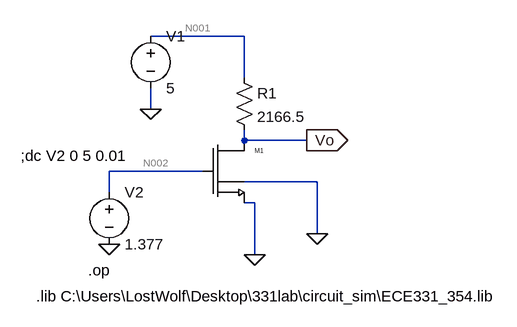
[diagram p0: schematic lab1_nmos.asc]
lab1_nmos.asc, the LTspice schematic file:
Version 4
SHEET 1 880 680
WIRE 176 -48 32 -48
WIRE 176 16 176 -48
WIRE 32 64 32 32
WIRE 176 112 176 96
WIRE 272 112 176 112
WIRE 112 160 -32 160
WIRE 288 176 176 176
WIRE -32 192 -32 160
WIRE 192 208 176 208
WIRE 288 256 288 176
WIRE 192 288 192 208
FLAG 192 288 0
FLAG 32 64 0
FLAG 288 256 0
FLAG -32 272 0
FLAG 272 112 Vo
IOPIN 272 112 Out
SYMBOL ALD1101 112 112 R0
SYMATTR InstName M1
SYMATTR SpiceModel ""
SYMATTR SpiceLine ""
SYMATTR Value ALD1101
SYMATTR Value2 W=1.379e-3 L=1E-6
SYMBOL res 160 0 R0
SYMATTR InstName R1
SYMATTR Value 2166.5
SYMBOL voltage 32 -64 R0
WINDOW 123 0 0 Left 2
WINDOW 39 0 0 Left 2
SYMATTR InstName V1
SYMATTR Value 5
SYMBOL voltage -32 176 R0
WINDOW 123 0 0 Left 2
WINDOW 39 0 0 Left 2
SYMATTR InstName V2
SYMATTR Value 1.377
TEXT -64 312 Left 2 !.op
TEXT -144 352 Left 2 !.lib C:\\Users\\LostWolf\\Desktop\\331lab\\circuit_sim\\ECE331_354.lib
TEXT -168 136 Left 2 !;dc V2 0 5 0.01

The netlist it stands for:
* lab1_nmos.asc
M1 Vo N002 0 0 ALD1101 W=1.379e-3 L=1E-6
R1 N001 Vo 2166.5
V1 N001 0 5
V2 N002 0 1.377
.model NMOS NMOS
.model PMOS PMOS
.lib standard.mos
.op
.lib C:\Users\LostWolf\Desktop\331lab\circuit_sim\ECE331_354.lib
;dc V2 0 5 0.01
.backanno
.end

* Results of the author's LTspice run, read from the files saved beside the schematic
* Operating Point:
*   V(vo) = 2.725 V
*   V(n002) = 1.377 V
*   V(n001) = 5 V
*   Id(M1) = 1.05 mA
*   Ig(M1) = 0 A
*   Ib(M1) = -2.743 pA
*   Is(M1) = -1.05 mA
*   I(R1) = 1.05 mA
*   I(V2) = 0 A
*   I(V1) = -1.05 mA
* From the log:
*   Semiconductor Device Operating Points:
*                           --- MOSFET Transistors ---
*   Name:          m1
*   Model:       ald1101
*   Id:          1.05e-03
*   Vgs:         1.38e+00
*   Vds:         2.73e+00
*   Vbs:         0.00e+00
*   Vth:         7.13e-01
*   Vdsat:       4.55e-01
*   Gm:          2.99e-03
*   Gds:         1.29e-05
*   Gmb:         1.42e-03
*   Cbd:         0.00e+00
*   Cbs:         0.00e+00
*   Cgsov:       1.59e-12
*   Cgdov:       1.59e-12
*   Cgbov:       0.00e+00
*   Cgs:         3.17e-12
*   Cgd:         0.00e+00
*   Cgb:         0.00e+00